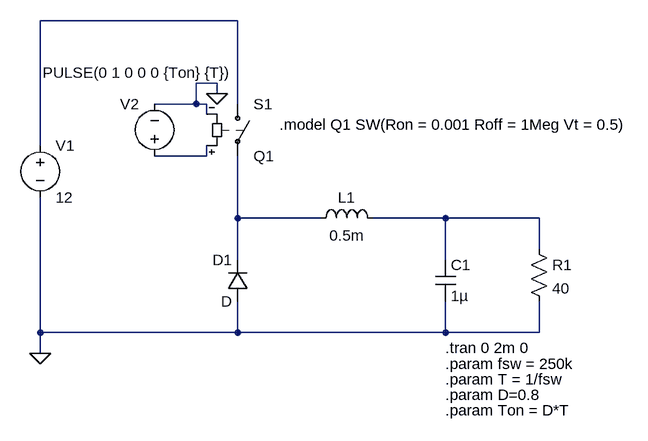
[diagram p0: schematic Open Loop Buck.asc]
Open Loop Buck.asc, the LTspice schematic file:
Version 4
SHEET 1 1016 680
WIRE 208 -208 -96 -208
WIRE 176 -112 144 -112
WIRE 176 -96 176 -112
WIRE 144 -80 144 -112
WIRE 144 -80 80 -80
WIRE 160 -80 144 -80
WIRE 208 -80 208 -208
WIRE 160 -64 160 -80
WIRE -96 -16 -96 -208
WIRE 160 0 160 -16
WIRE 160 0 80 0
WIRE 208 96 208 0
WIRE 336 96 208 96
WIRE 528 96 416 96
WIRE 672 96 528 96
WIRE 672 144 672 96
WIRE 208 160 208 96
WIRE 528 160 528 96
WIRE -96 272 -96 64
WIRE 208 272 208 224
WIRE 208 272 -96 272
WIRE 528 272 528 224
WIRE 528 272 208 272
WIRE 672 272 672 224
WIRE 672 272 528 272
WIRE -96 304 -96 272
FLAG 176 -96 0
FLAG -96 304 0
SYMBOL voltage -96 -32 R0
WINDOW 123 0 0 Left 0
WINDOW 39 0 0 Left 0
SYMATTR InstName V1
SYMATTR Value 12
SYMBOL ind 320 112 R270
WINDOW 0 32 56 VTop 2
WINDOW 3 5 56 VBottom 2
SYMATTR InstName L1
SYMATTR Value 0.5m
SYMBOL res 656 128 R0
SYMATTR InstName R1
SYMATTR Value 40
SYMBOL diode 224 224 R180
WINDOW 0 24 64 Left 2
WINDOW 3 24 0 Left 2
SYMATTR InstName D1
SYMBOL sw 208 -96 R0
SYMATTR InstName S1
SYMATTR Value Q1
SYMBOL cap 512 160 R0
SYMATTR InstName C1
SYMATTR Value 1µ
SYMBOL voltage 80 16 R180
WINDOW 0 24 96 Left 2
WINDOW 3 -120 144 Left 2
WINDOW 123 0 0 Left 0
WINDOW 39 0 0 Left 0
SYMATTR InstName V2
SYMATTR Value PULSE(0 1 0 0 0 {Ton} {T})
TEXT 528 296 Left 2 !.tran 0 2m 0
TEXT 528 320 Left 2 !.param fsw = 250k
TEXT 528 344 Left 2 !.param T = 1/fsw
TEXT 528 368 Left 2 !.param D=0.8
TEXT 528 392 Left 2 !.param Ton = D*T
TEXT 272 -48 Left 2 !.model Q1 SW(Ron = 0.001 Roff = 1Meg Vt = 0.5)

The netlist it stands for:
* Open Loop Buck.asc
V1 N001 0 12
L1 N003 N004 0.5m
R1 N004 0 40
D1 0 N003 D
S1 N001 N003 N002 0 Q1
C1 N004 0 1µ
V2 N002 0 PULSE(0 1 0 0 0 {Ton} {T})
.model D D
.lib standard.dio
.tran 0 2m 0
.param fsw = 250k
.param T = 1/fsw
.param D=0.8
.param Ton = D*T
.model Q1 SW(Ron = 0.001 Roff = 1Meg Vt = 0.5)
.backanno
.end